# EAGLE design display (EAGLE 9.5.1)
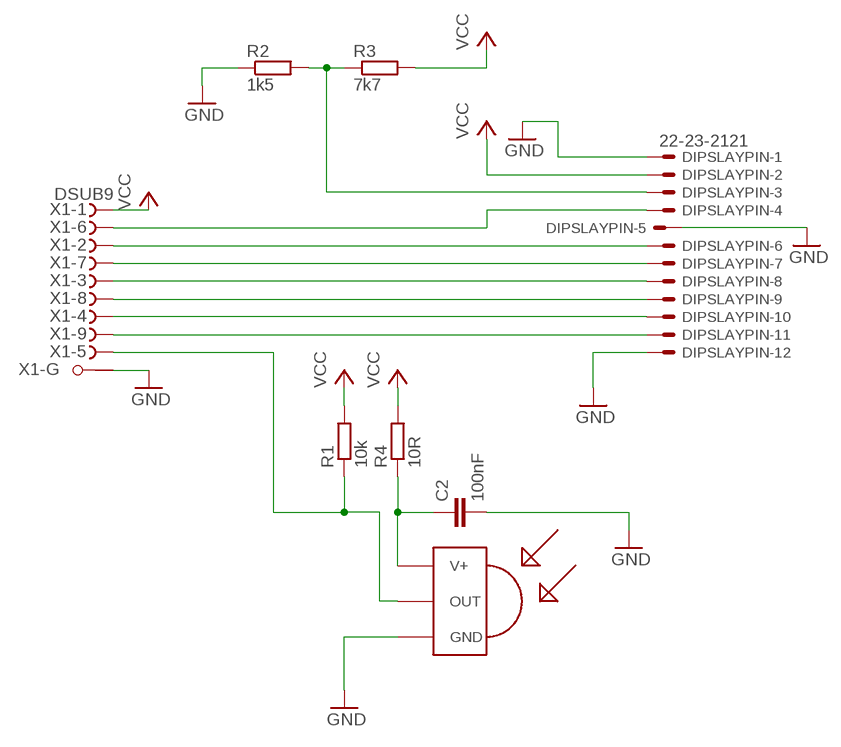
[diagram p0: schematic, sheet 1]

## Parts
C2  100nF  C-EU025-025X050  [C025-025X050]
DIPSLAYPIN  22-23-2121  [22-23-2121]
R1  10k  R-EU_0207/10  [0207/10]
R2  1k5  R-EU_0207/10  [0207/10]
R3  7k7  R-EU_0207/10  [0207/10]
R4  10R  R-EU_0207/10  [0207/10]
U$1  TSOP4838  [TSOP18XX]
X1  DSUB9  F09HPS  [F09HP]

## Nets
GND: C2.2 DIPSLAYPIN.1 DIPSLAYPIN.5 DIPSLAYPIN.12 R2.1 U$1.GND X1.G1(-G:G1)
N$1: DIPSLAYPIN.6 X1.2(-2:F)
N$2: DIPSLAYPIN.7 X1.7(-7:F)
N$3: DIPSLAYPIN.8 X1.3(-3:F)
N$4: DIPSLAYPIN.9 X1.8(-8:F)
N$5: DIPSLAYPIN.10 X1.4(-4:F)
N$6: DIPSLAYPIN.11 X1.9(-9:F)
N$7: R1.1 U$1.OUT X1.5(-5:F)
N$8: DIPSLAYPIN.4 X1.6(-6:F)
N$9: DIPSLAYPIN.3 R2.2 R3.1
N$10: C2.1 R4.1 U$1.VCC(V+)
VCC: DIPSLAYPIN.2 R1.2 R3.2 R4.2 X1.1(-1:F)
Unconnected: X1.G2(-G:G2)

## Library data of the parts
C2 = rcl:C-EU: CAPACITOR, European symbol; SPICEPREFIX: C
DIPSLAYPIN = con-molex:22-23-2121: .100" (2.54mm) Center Header - 12 Pin; MF: MOLEX; MPN: 22-23-2121; OC_FARNELL: 1462935; OC_NEWARK: 56H0456
R1-R4 = rcl:R-EU_: RESISTOR, European symbol; SPICEPREFIX: R
U$1 = tsop:TSOP4838: IR Receiver and Demodulator
X1 = con-subd:F09HPS: SUB-D; OC_FARNELL: unknown; OC_NEWARK: unknown

## Board
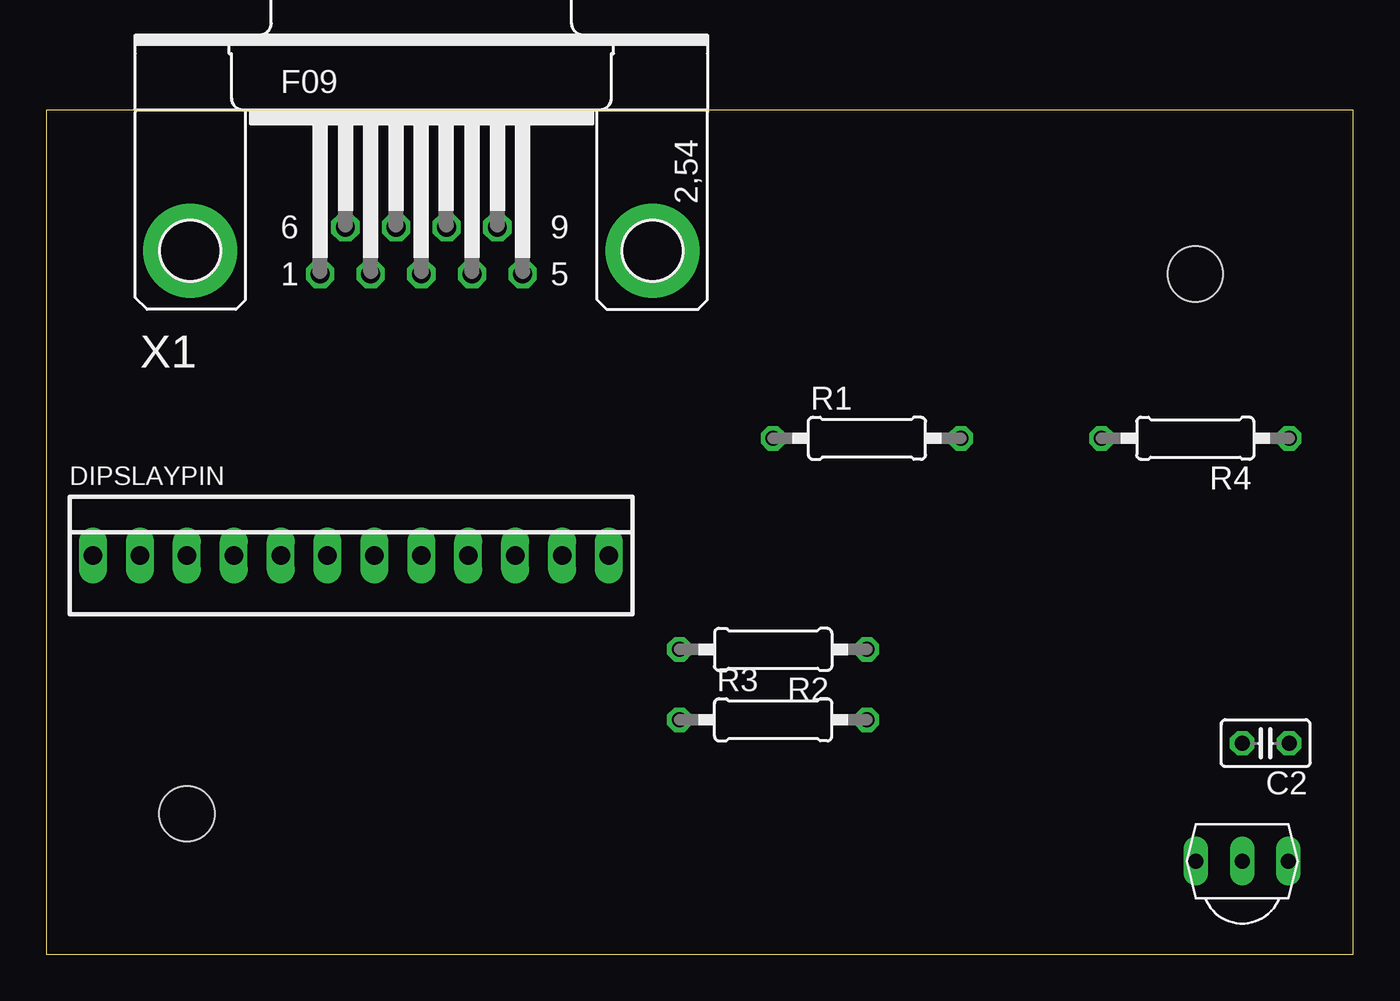
[diagram p1: board, top side]
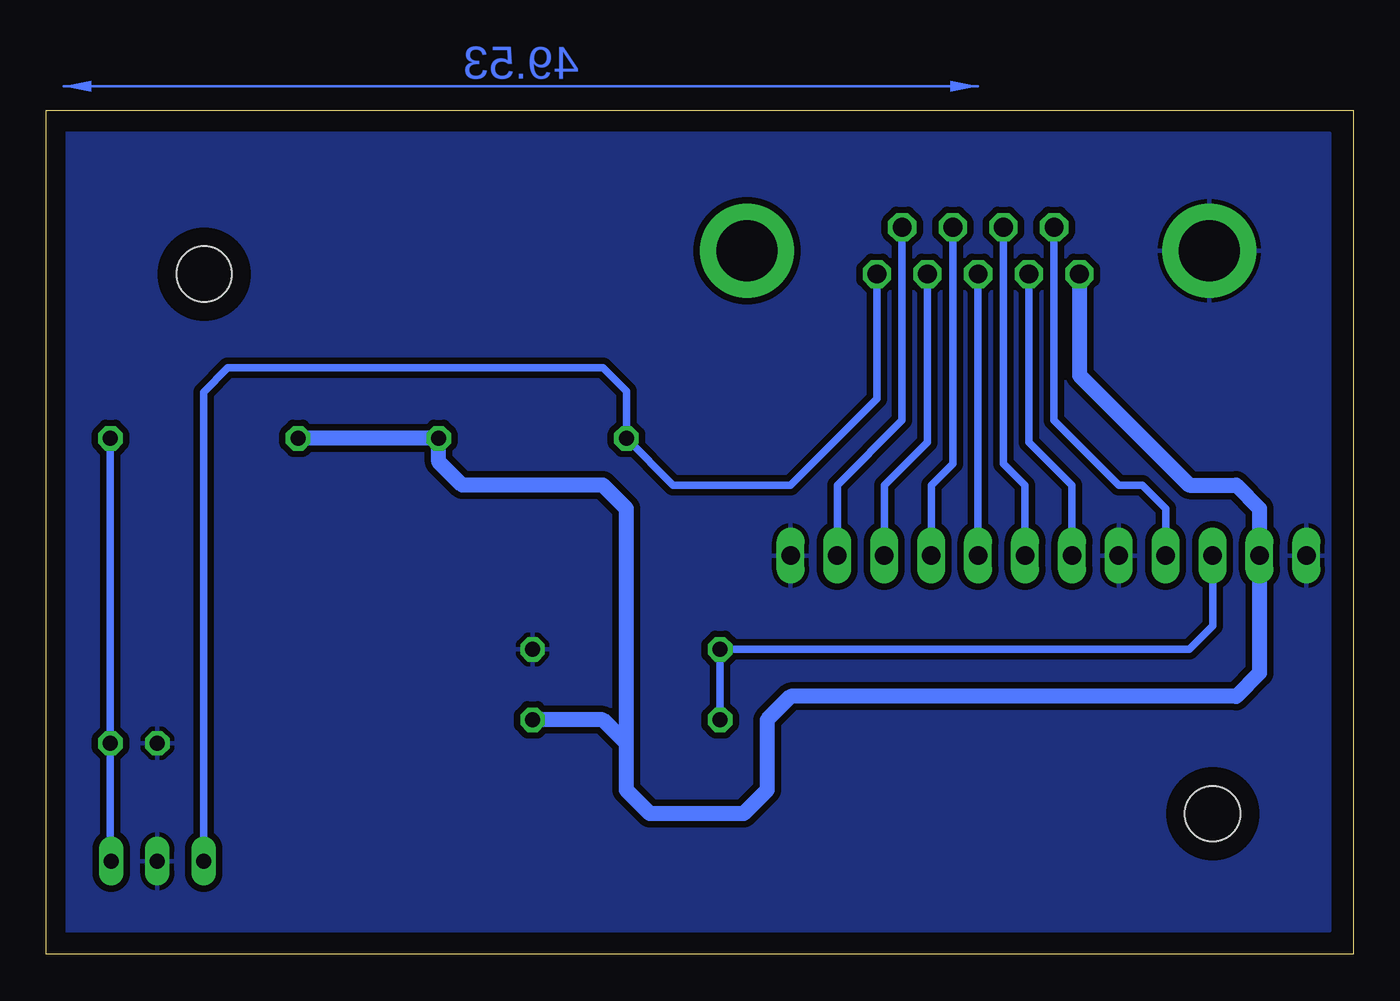
[diagram p2: board, bottom side, seen from below]

Size 70.79 x 45.71 mm. Coordinates in mm from the lower left corner, seen from the top.
Outline: 0,0 70.79,0 70.79,45.71 0,45.71 0,0
Copper layers (1*16): Top 0.035mm / dielectric 1.5mm / Bottom 0.035mm
Design rules "default *": minimum track width 6mil, minimum drill 0.35mm, track to track 6mil, track to pad 6mil, pad to pad 6mil, via to via 6mil, smd to smd 6mil, copper to edge 40mil, drill to drill 6mil, minimum pad ring 10mil, minimum via ring 8mil, stop-mask expansion 4mil, vias tented up to drill 0mil, thermal gap 10mil
Holes 3 mm at 7.62,7.62 62.23,36.83

### Footprints (pad centres in the part's own frame; a part is rotated, then mirrored left to right if it is on the bottom)
C025-025X050 = drill 0.813 octagon: 1 -1.27,0; 2 1.27,0
22-23-2121 = drill 1 long: 1 -13.97,0; 2 -11.43,0; 3 -8.89,0; 4 -6.35,0; 5 -3.81,0; 6 -1.27,0; 7 1.27,0; 8 3.81,0; 9 6.35,0; 10 8.89,0; 11 11.43,0; 12 13.97,0
0207/10 = drill 0.813 octagon: 1 -5.08,0; 2 5.08,0
TSOP18XX = drill 0.813 long: GND -0.001,-0.027; OUT -2.501,-0.027; VCC 2.499,-0.027
F09HP = drill 1.016 octagon: 1 -5.486,-1.27; 2 -2.743,-1.27; 3 0,-1.27; 4 2.743,-1.27; 5 5.486,-1.27; 6 -4.115,1.27; 7 -1.372,1.27; 8 1.372,1.27; 9 4.115,1.27 | drill 3.302 pad 5.08: G1 -12.522,0; G2 12.522,0

### Placement (x,y rotation side)
C2  66.04,11.43 180 top
DIPSLAYPIN  16.51,21.59 0 top
R1  44.45,27.94 0 top
R2  39.37,16.51 180 top
R3  39.37,12.7 0 top
R4  62.23,27.94 180 top
U$1  64.77,5.08 0 top
X1  20.32,38.1 0 top

### Tracks (layer width: path | path; a pad name or v marks a point on that pad's centre or on a via)
GND
  pour Bottom (isolate 0.35): 1.27,44.45 69.85,44.45 69.85,1.27 1.27,1.27
N$1
  Bottom 0.406: X1.2 17.58,27.74 15.24,25.4 DIPSLAYPIN.6
N$2
  Bottom 0.406: X1.7 18.95,26.57 17.78,25.4 DIPSLAYPIN.7
N$3
  Bottom 0.406: X1.3 DIPSLAYPIN.8
N$4
  Bottom 0.406: X1.8 21.69,26.57 22.86,25.4 DIPSLAYPIN.9
N$5
  Bottom 0.406: X1.4 23.06,27.74 25.4,25.4 DIPSLAYPIN.10
N$6
  Bottom 0.406: X1.9 24.44,28.91 27.94,25.4 DIPSLAYPIN.11
N$7
  Bottom 0.406: X1.5 25.81,30.07 30.48,25.4 36.83,25.4 R1.1 39.37,30.48 40.64,31.75 60.96,31.75 62.27,30.44 U$1.OUT
N$8
  Bottom 0.406: DIPSLAYPIN.4 10.16,24.13 11.43,25.4 12.7,25.4 16.2,28.91 X1.6
N$9
  Bottom 0.406: DIPSLAYPIN.3 7.62,17.78 8.89,16.51 R2.2 R3.1
N$10
  Bottom 0.406: R4.1 C2.1 67.31,5.09 U$1.VCC
VCC
  Bottom 0.813: X1.1 14.83,31.34 8.89,25.4 6.35,25.4 5.08,24.13 DIPSLAYPIN.2 5.08,15.24 6.35,13.97 30.48,13.97 31.75,12.7 31.75,8.89 33.02,7.62 38.1,7.62 39.37,8.89 39.37,11.43 | 39.37,11.43 39.37,24.13 40.64,25.4 48.26,25.4 49.53,26.67 R1.2 R4.2 | 39.37,11.43 40.64,12.7 R3.2
(copper drawn outside any net)
  shapes: Bottom area x1